# Altium schematic sheet CONTROLLER-RK3562.SchDoc
size A2; SheetNumber: 3; SheetTotal: 32
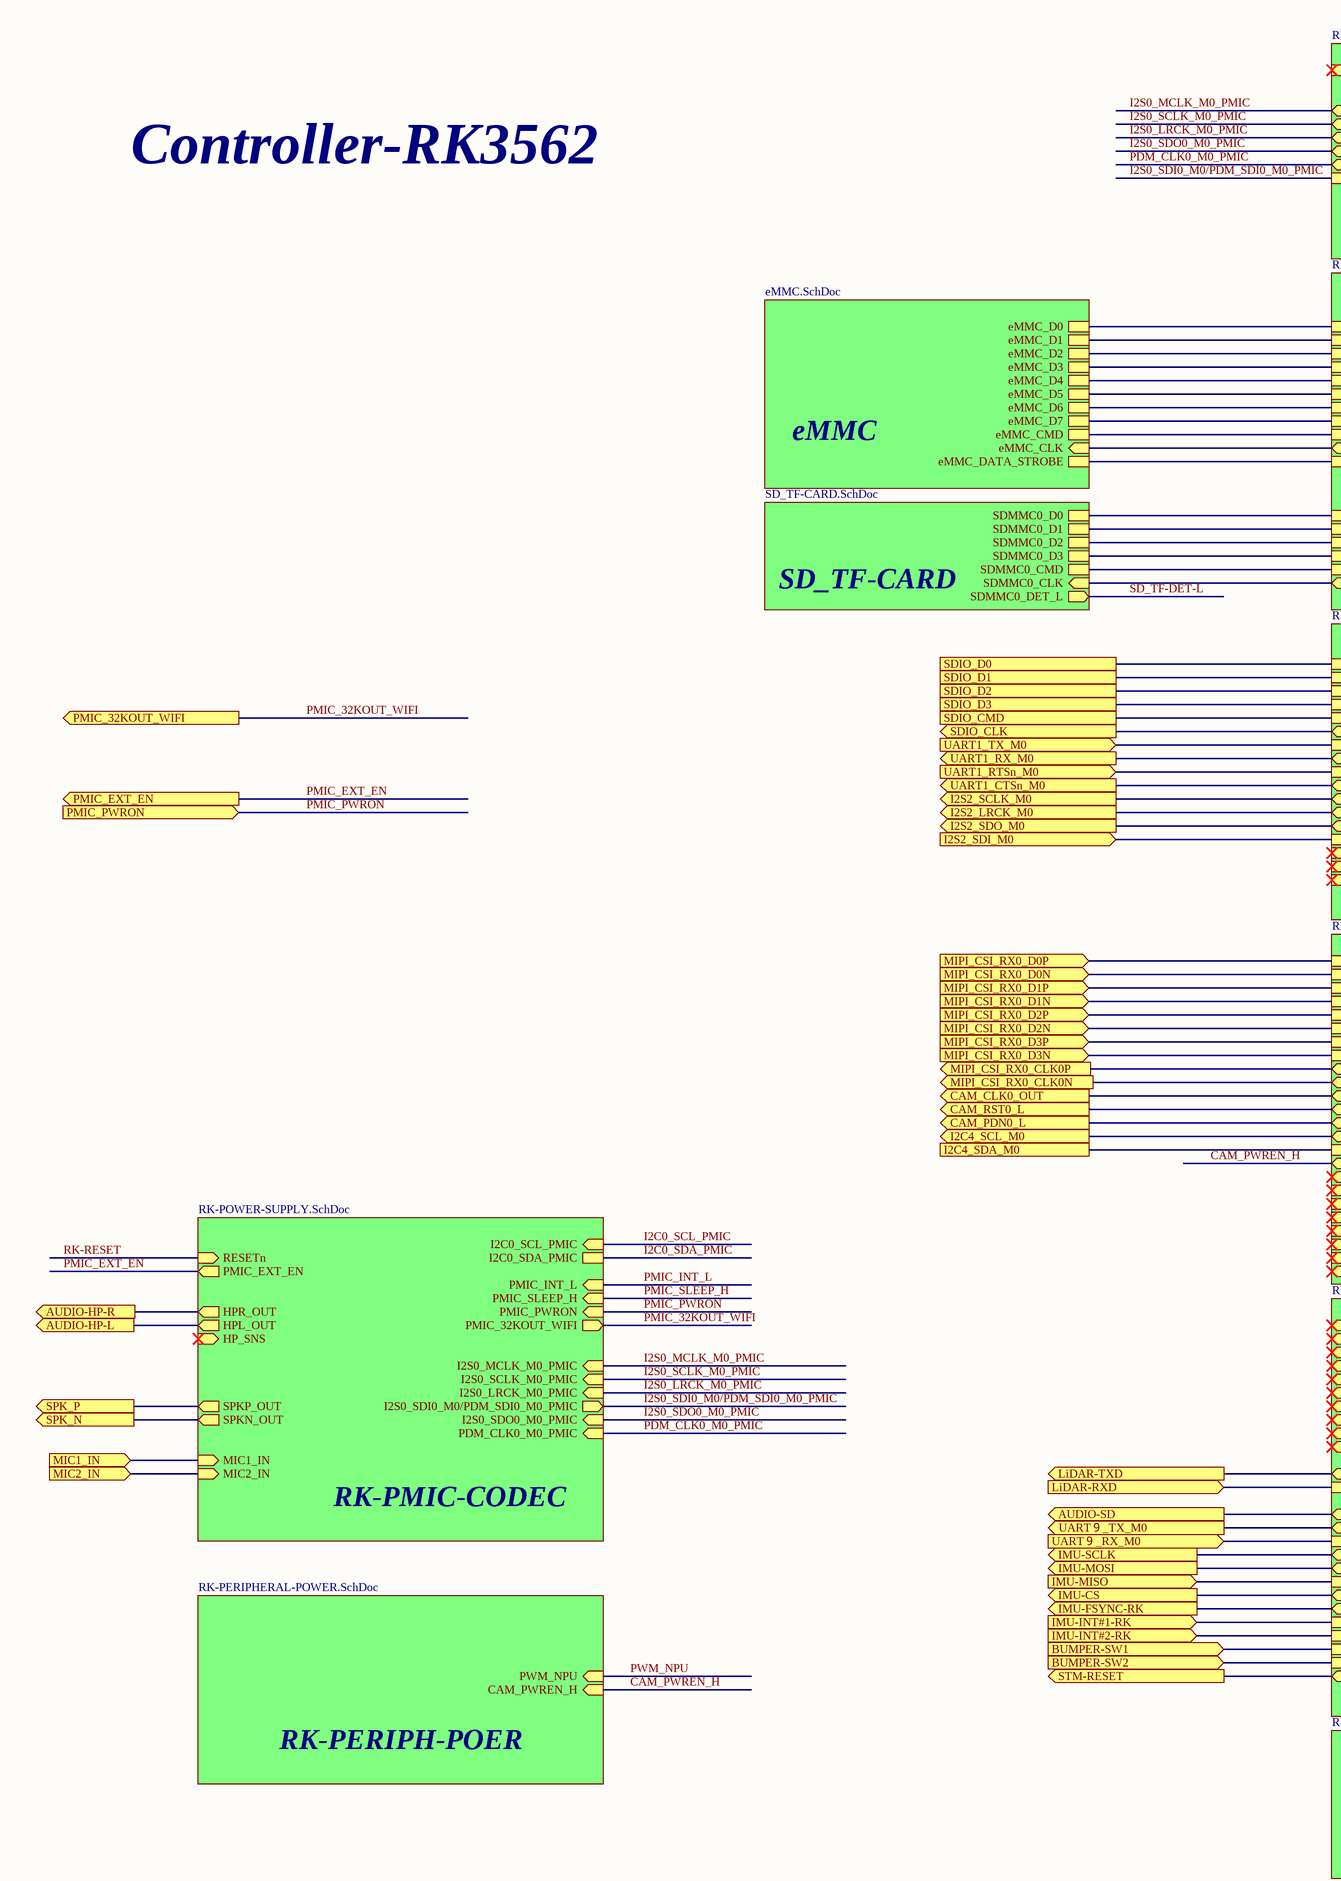
[diagram p0: CONTROLLER-RK3562.SchDoc, left]
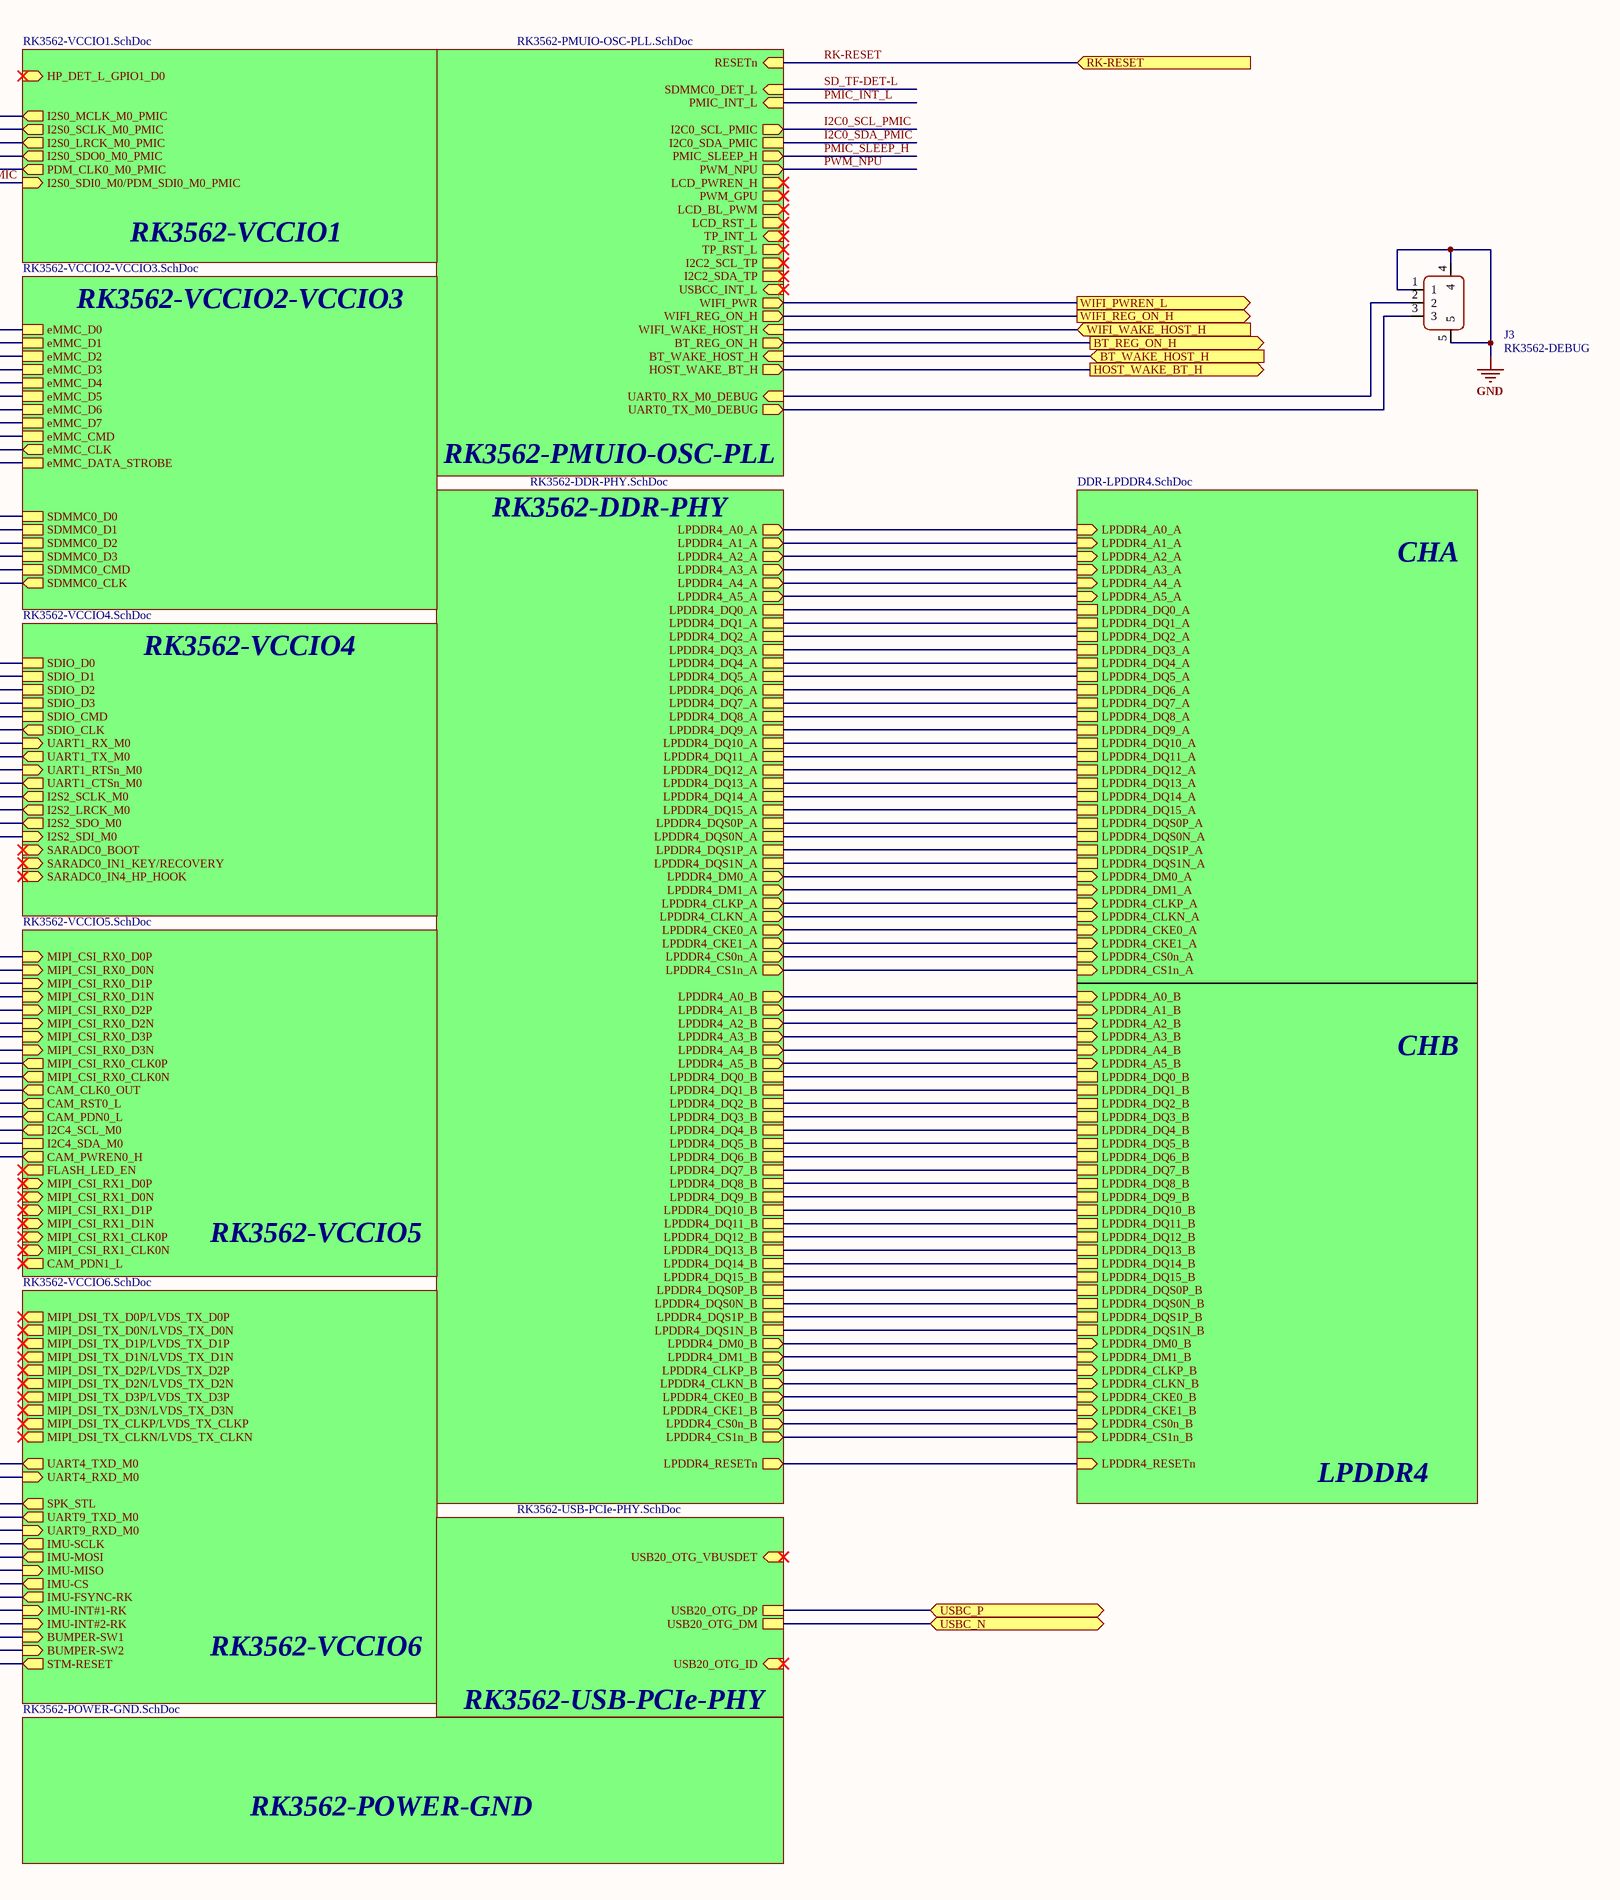
[diagram p1: CONTROLLER-RK3562.SchDoc, right]

## Parts
J3  RK3562-DEBUG  [MHDR1X3]

## Sub-sheets
DRAM-LPDDR4 = DDR-LPDDR4.SchDoc: LPDDR4_DQ0_B, LPDDR4_DQ0_A, LPDDR4_DQ1_B, LPDDR4_DQ1_A, LPDDR4_DQ2_B, LPDDR4_DQ2_A, LPDDR4_DQ3_B, LPDDR4_DQ3_A, LPDDR4_DQ4_A, LPDDR4_DQ4_B, LPDDR4_DQ5_A, LPDDR4_DQ5_B, LPDDR4_DQ6_A, LPDDR4_DQ6_B, LPDDR4_DQ7_B, LPDDR4_DQ7_A, LPDDR4_DQS0P_B, LPDDR4_DQS0P_A, LPDDR4_DQS0N_A, LPDDR4_DQS0N_B, LPDDR4_DM0_B (in), LPDDR4_DQ8_B, LPDDR4_DQ8_A, LPDDR4_DQ9_B, LPDDR4_DQ9_A, LPDDR4_DQ10_B, LPDDR4_DQ10_A, LPDDR4_DQ11_A, LPDDR4_DQ11_B, LPDDR4_DQ12_A, LPDDR4_DQ12_B, LPDDR4_DQ13_B, LPDDR4_DQ13_A, LPDDR4_DQ14_B, LPDDR4_DQ14_A, LPDDR4_DQ15_B, LPDDR4_DQ15_A, LPDDR4_DQS1P_A, LPDDR4_DQS1P_B, LPDDR4_DQS1N_B, LPDDR4_DQS1N_A, LPDDR4_DM1_B (in), LPDDR4_A0_A (in), LPDDR4_A0_B (in), LPDDR4_A1_B (in), LPDDR4_A1_A (in), LPDDR4_A2_A (in), LPDDR4_A2_B (in), LPDDR4_A3_B (in), LPDDR4_A3_A (in), LPDDR4_A4_B (in), LPDDR4_A4_A (in), LPDDR4_A5_B (in), LPDDR4_A5_A (in), LPDDR4_CLKP_B (in), LPDDR4_CLKP_A (in), LPDDR4_CLKN_B (in), LPDDR4_CLKN_A (in), LPDDR4_CKE0_B (in), LPDDR4_CKE0_A (in), LPDDR4_CKE1_A (in), LPDDR4_CKE1_B (in), LPDDR4_CS0n_A (in), LPDDR4_CS0n_B (in), LPDDR4_CS1n_A (in), LPDDR4_CS1n_B (in), LPDDR4_RESETn (in), LPDDR4_DM0_A (in), LPDDR4_DM1_A (in)
eMMC = eMMC.SchDoc: eMMC_D0, eMMC_D1, eMMC_D2, eMMC_D3, eMMC_D4, eMMC_D5, eMMC_D6, eMMC_D7, eMMC_CMD, eMMC_DATA_STROBE, eMMC_CLK (in)
RK3562-DDR-PHY = RK3562-DDR-PHY.SchDoc: LPDDR4_CLKN_B (out), LPDDR4_DQ0_A, LPDDR4_DQ1_A, LPDDR4_DQ2_A, LPDDR4_A1_A (out), LPDDR4_DQ3_A, LPDDR4_CS0n_A (out), LPDDR4_DQ4_A, LPDDR4_DQ5_A, LPDDR4_A3_B (out), LPDDR4_A5_B (out), LPDDR4_DQ6_A, LPDDR4_A1_B (out), LPDDR4_DQ7_A, LPDDR4_A0_B (out), LPDDR4_DM0_A (out), LPDDR4_DQS0P_A, LPDDR4_CLKP_B (out), LPDDR4_DQS0N_A, LPDDR4_CKE0_B (out), LPDDR4_A0_A (out), LPDDR4_DQ8_A, LPDDR4_A3_A (out), LPDDR4_DQ9_A, LPDDR4_DQ10_A, LPDDR4_A4_A (out), LPDDR4_DQ11_A, LPDDR4_A2_A (out), LPDDR4_DQ12_A, LPDDR4_DQ13_A, LPDDR4_A5_A (out), LPDDR4_DQ14_A, LPDDR4_CKE1_B (out), LPDDR4_DQ15_A, LPDDR4_A2_B (out), LPDDR4_A4_B (out), LPDDR4_DM1_A (out), LPDDR4_DQS1P_A, LPDDR4_CKE0_A (out), LPDDR4_DQS1N_A, LPDDR4_CLKN_A (out), LPDDR4_DQ0_B, LPDDR4_CLKP_A (out), LPDDR4_DQ1_B, LPDDR4_CKE1_A (out), LPDDR4_DQ2_B, LPDDR4_DQ3_B, LPDDR4_CS1n_A (out), LPDDR4_DQ4_B, LPDDR4_CS1n_B (out), LPDDR4_DQ5_B, LPDDR4_CS0n_B (out), LPDDR4_DQ6_B, LPDDR4_DQ7_B, LPDDR4_RESETn (out), LPDDR4_DM0_B (out), LPDDR4_DQS0P_B, LPDDR4_DQS0N_B, LPDDR4_DQ8_B, LPDDR4_DQ9_B, LPDDR4_DQ10_B, LPDDR4_DQ11_B, LPDDR4_DQ12_B, LPDDR4_DQ13_B, LPDDR4_DQ14_B, LPDDR4_DQ15_B, LPDDR4_DM1_B (out), LPDDR4_DQS1P_B, LPDDR4_DQS1N_B
RK3562-PMUIO-OSC-PLL = RK3562-PMUIO-OSC-PLL.SchDoc: RESETn (in), WIFI_PWR (out), PMIC_SLEEP_H (out), PMIC_INT_L (in), SDMMC0_DET_L (in), USBCC_INT_L (in), LCD_PWREN_H (out), I2C0_SCL_PMIC (out), I2C0_SDA_PMIC, WIFI_REG_ON_H (out), WIFI_WAKE_HOST_H (in), I2C2_SCL_TP (out), I2C2_SDA_TP, TP_RST_L (out), PWM_GPU (out), PWM_NPU (out), LCD_BL_PWM (out), TP_INT_L (in), LCD_RST_L (out), BT_REG_ON_H (out), BT_WAKE_HOST_H (in), HOST_WAKE_BT_H (out), UART0_RX_M0_DEBUG (in), UART0_TX_M0_DEBUG (out)
RK3562-POWER = RK3562-POWER-GND.SchDoc: no entries
RK3562-USB-PCIe-PHY = RK3562-USB-PCIe-PHY.SchDoc: USB20_OTG_DP, USB20_OTG_DM, USB20_OTG_VBUSDET (in), USB20_OTG_ID (in)
RK3562-VCCIO1 = RK3562-VCCIO1.SchDoc: HP_DET_L_GPIO1_D0 (in), I2S0_MCLK_M0_PMIC (out), I2S0_SCLK_M0_PMIC (out), I2S0_LRCK_M0_PMIC (out), I2S0_SDO0_M0_PMIC (out), PDM_CLK0_M0_PMIC (out), I2S0_SDI0_M0/PDM_SDI0_M0_PMIC (in)
RK3562-VCCIO2-VCCIO3 = RK3562-VCCIO2-VCCIO3.SchDoc: eMMC_D0, eMMC_D1, eMMC_D2, eMMC_D3, eMMC_D4, eMMC_D5, eMMC_D6, eMMC_D7, eMMC_CMD, eMMC_CLK (out), eMMC_DATA_STROBE, SDMMC0_D0, SDMMC0_D1, SDMMC0_D2, SDMMC0_D3, SDMMC0_CMD, SDMMC0_CLK (out)
RK3562-VCCIO4 = RK3562-VCCIO4.SchDoc: SDIO_D0, SDIO_D1, SDIO_D2, SDIO_D3, SDIO_CMD, SDIO_CLK (out), UART1_RX_M0 (in), UART1_TX_M0 (out), UART1_RTSn_M0 (in), UART1_CTSn_M0 (out), I2S2_SCLK_M0 (out), I2S2_LRCK_M0 (out), I2S2_SDO_M0 (out), I2S2_SDI_M0 (in), SARADC0_BOOT (in), SARADC0_IN1_KEY/RECOVERY (in), SARADC0_IN4_HP_HOOK (in)
RK3562-VCCIO5 = RK3562-VCCIO5.SchDoc: MIPI_CSI_RX0_D0P (in), MIPI_CSI_RX0_D0N (in), MIPI_CSI_RX0_D1P (in), MIPI_CSI_RX0_D1N (in), MIPI_CSI_RX0_D2P (in), MIPI_CSI_RX0_D2N (in), MIPI_CSI_RX0_D3P (in), MIPI_CSI_RX0_D3N (in), MIPI_CSI_RX1_D0P (in), MIPI_CSI_RX1_D0N (in), MIPI_CSI_RX1_D1P (in), MIPI_CSI_RX1_D1N (in), MIPI_CSI_RX1_CLK0P (in), MIPI_CSI_RX1_CLK0N (in), CAM_CLK0_OUT (out), CAM_PWREN0_H (out), CAM_PDN1_L (out), CAM_RST0_L (out), I2C4_SCL_M0 (out), I2C4_SDA_M0, CAM_PDN0_L (out), FLASH_LED_EN (out), MIPI_CSI_RX0_CLK0P (out), MIPI_CSI_RX0_CLK0N (out)
RK3562-VCCIO6 = RK3562-VCCIO6.SchDoc: MIPI_DSI_TX_D0P/LVDS_TX_D0P (out), MIPI_DSI_TX_D0N/LVDS_TX_D0N (out), MIPI_DSI_TX_D1P/LVDS_TX_D1P (out), MIPI_DSI_TX_D1N/LVDS_TX_D1N (out), MIPI_DSI_TX_D2P/LVDS_TX_D2P (out), MIPI_DSI_TX_D2N/LVDS_TX_D2N (out), MIPI_DSI_TX_D3P/LVDS_TX_D3P (out), MIPI_DSI_TX_D3N/LVDS_TX_D3N (out), MIPI_DSI_TX_CLKP/LVDS_TX_CLKP (out), MIPI_DSI_TX_CLKN/LVDS_TX_CLKN (out), UART4_TXD_M0 (out), UART4_RXD_M0 (in), SPK_STL (out), STM-RESET (out), BUMPER-SW1 (in), BUMPER-SW2 (in), IMU-SCLK (out), IMU-MOSI (out), IMU-MISO (in), IMU-CS (out), IMU-FSYNC-RK (out), IMU-INT#1-RK (in), IMU-INT#2-RK (in), UART9_TXD_M0 (out), UART9_RXD_M0 (in)
RK-PERIPHERAL-POWER = RK-PERIPHERAL-POWER.SchDoc: PWM_NPU (in), CAM_PWREN_H (in)
RK-POWER-SUPPLY = RK-POWER-SUPPLY.SchDoc: HPL_OUT (out), HP_SNS (in), I2C0_SDA_PMIC, HPR_OUT (out), PMIC_INT_L (in), SPKN_OUT (out), RESETn (in), SPKP_OUT (out), MIC1_IN (in), PMIC_32KOUT_WIFI (out), MIC2_IN (in), I2S0_MCLK_M0_PMIC (in), I2S0_SCLK_M0_PMIC (in), I2S0_LRCK_M0_PMIC (in), I2S0_SDO0_M0_PMIC (in), I2S0_SDI0_M0/PDM_SDI0_M0_PMIC (out), PDM_CLK0_M0_PMIC (in), I2C0_SCL_PMIC (in), PMIC_PWRON (in), PMIC_SLEEP_H (in), PMIC_EXT_EN (out)
SD/TF CARD = SD_TF-CARD.SchDoc: SDMMC0_D0, SDMMC0_D1, SDMMC0_D2, SDMMC0_D3, SDMMC0_CMD, SDMMC0_CLK (in), SDMMC0_DET_L (out)

## Ports
AUDIO-HP-L (out, see Controller-RK3562-TOP[6C], SPEAKER-MIC[1A]), AUDIO-HP-R (out, see Controller-RK3562-TOP[6C], SPEAKER-MIC[1A]), AUDIO-SD (out, see Controller-RK3562-TOP[6C], SPEAKER-MIC[1B]), BT_REG_ON_H (out, see Controller-RK3562-TOP[5C], RK3562-PMUIO-OSC-PLL[5C], WF-BT-AP6256[1A]), BT_WAKE_HOST_H (in, see Controller-RK3562-TOP[5C], RK3562-PMUIO-OSC-PLL[5C], WF-BT-AP6256[1A]), BUMPER-SW1 (in, see Controller-RK3562-TOP[5B], RK3562-VCCIO6[4C]), BUMPER-SW2 (in, see Controller-RK3562-TOP[5B], RK3562-VCCIO6[4C]), CAM_CLK0_OUT (out, see Controller-RK3562-TOP[6B], MIPI-CAMERA[1B], RK3562-VCCIO5[4D]), CAM_PDN0_L (out, see Controller-RK3562-TOP[6B], MIPI-CAMERA[1C], RK3562-VCCIO5[4D]), CAM_RST0_L (out, see Controller-RK3562-TOP[6B], MIPI-CAMERA[1B], RK3562-VCCIO5[4D]), HOST_WAKE_BT_H (out, see Controller-RK3562-TOP[5C], RK3562-PMUIO-OSC-PLL[5C], WF-BT-AP6256[1A]), I2C4_SCL_M0 (out, see Controller-RK3562-TOP[6B], MIPI-CAMERA[1B], RK3562-VCCIO5[4D]), I2C4_SDA_M0 (see Controller-RK3562-TOP[6B], MIPI-CAMERA[1B], RK3562-VCCIO5[4D]), I2S2_LRCK_M0 (out, see Controller-RK3562-TOP[5C], RK3562-VCCIO4[4B], WF-BT-AP6256[1A]), I2S2_SCLK_M0 (out, see Controller-RK3562-TOP[5C], RK3562-VCCIO4[4B], WF-BT-AP6256[1A]), I2S2_SDI_M0 (in, see Controller-RK3562-TOP[5C], RK3562-VCCIO4[4B], WF-BT-AP6256[1B]), I2S2_SDO_M0 (out, see Controller-RK3562-TOP[5C], RK3562-VCCIO4[4B], WF-BT-AP6256[1B]), IMU-CS (out, see Controller-RK3562-TOP[6C], RK3562-VCCIO6[4D]), IMU-FSYNC-RK (out, see Controller-RK3562-TOP[6C], RK3562-VCCIO6[4C]), IMU-INT#1-RK (in, see Controller-RK3562-TOP[6C], RK3562-VCCIO6[4C]), IMU-INT#2-RK (in, see Controller-RK3562-TOP[6C], RK3562-VCCIO6[4C]), IMU-MISO (in, see Controller-RK3562-TOP[6C], RK3562-VCCIO6[4C]), IMU-MOSI (out, see Controller-RK3562-TOP[6C], RK3562-VCCIO6[4C]), IMU-SCLK (out, see Controller-RK3562-TOP[6C], RK3562-VCCIO6[4D]), LiDAR-RXD (in, see Controller-RK3562-TOP[6B], LiDAR [1B]), LiDAR-TXD (out, see Controller-RK3562-TOP[6B]), MIC1_IN (in, see Controller-RK3562-TOP[6C], RK-POWER-SUPPLY[4A], SPEAKER-MIC[1C]), MIC2_IN (in, see Controller-RK3562-TOP[6C], RK-POWER-SUPPLY[4A], SPEAKER-MIC[1D]), MIPI_CSI_RX0_CLK0N (out, see Controller-RK3562-TOP[6B], MIPI-CAMERA[1B], RK3562-VCCIO5[2B]), MIPI_CSI_RX0_CLK0P (out, see Controller-RK3562-TOP[6B], MIPI-CAMERA[1B], RK3562-VCCIO5[2A]), MIPI_CSI_RX0_D0N (in, see Controller-RK3562-TOP[6B], MIPI-CAMERA[1B], RK3562-VCCIO5[2A]), MIPI_CSI_RX0_D0P (in, see Controller-RK3562-TOP[6B], MIPI-CAMERA[1B], RK3562-VCCIO5[2A]), MIPI_CSI_RX0_D1N (in, see Controller-RK3562-TOP[6B], MIPI-CAMERA[1B], RK3562-VCCIO5[2A]), MIPI_CSI_RX0_D1P (in, see Controller-RK3562-TOP[6B], MIPI-CAMERA[1B], RK3562-VCCIO5[2A]), MIPI_CSI_RX0_D2N (in, see Controller-RK3562-TOP[6B], MIPI-CAMERA[1B], RK3562-VCCIO5[2A]), MIPI_CSI_RX0_D2P (in, see Controller-RK3562-TOP[6B], MIPI-CAMERA[1B], RK3562-VCCIO5[2A]), MIPI_CSI_RX0_D3N (in, see Controller-RK3562-TOP[6B], MIPI-CAMERA[1B], RK3562-VCCIO5[2A]), MIPI_CSI_RX0_D3P (in, see Controller-RK3562-TOP[6B], MIPI-CAMERA[1B], RK3562-VCCIO5[2A]), PMIC_32KOUT_WIFI (out, see Controller-RK3562-TOP[5C], RK-POWER-SUPPLY[1A], WF-BT-AP6256[1B]), PMIC_EXT_EN (out, see Controller-RK3562-TOP[5C], BMS-SYSTEM-POWER[1D], RK-POWER-SUPPLY[1A]), PMIC_PWRON (in, see Controller-RK3562-TOP[5C], RK-POWER-SUPPLY[1A], STM32G070RBT6[2B]), RK-RESET (in, see Controller-RK3562-TOP[5B], STM32G070RBT6[2C]), SDIO_CLK (out, see Controller-RK3562-TOP[6C], RK3562-VCCIO4[4A], WF-BT-AP6256[1A]), SDIO_CMD (see Controller-RK3562-TOP[6C], RK3562-VCCIO4[4A], WF-BT-AP6256[1A]), SDIO_D0 (see Controller-RK3562-TOP[6C], RK3562-VCCIO4[4A], WF-BT-AP6256[1A]), SDIO_D1 (see Controller-RK3562-TOP[6C], RK3562-VCCIO4[4A], WF-BT-AP6256[1A]), SDIO_D2 (see Controller-RK3562-TOP[6C], RK3562-VCCIO4[4A], WF-BT-AP6256[1A]), SDIO_D3 (see Controller-RK3562-TOP[6C], RK3562-VCCIO4[4A], WF-BT-AP6256[1A]), SPK_N (out, see Controller-RK3562-TOP[6C], SPEAKER-MIC[3C]), SPK_P (out, see Controller-RK3562-TOP[6C], SPEAKER-MIC[3C]), STM-RESET (out, see Controller-RK3562-TOP[5B], RK3562-VCCIO6[4C], STM32G070RBT6[1A]), UART1_CTSn_M0 (out, see Controller-RK3562-TOP[5C], RK3562-VCCIO4[4B], WF-BT-AP6256[1A]), UART1_RTSn_M0 (in, see Controller-RK3562-TOP[5C], RK3562-VCCIO4[4B], WF-BT-AP6256[1A]), UART1_RX_M0 (out, see Controller-RK3562-TOP[6C], WF-BT-AP6256[1A]), UART1_TX_M0 (in, see Controller-RK3562-TOP[5C], WF-BT-AP6256[1A]), UART９_RX_M0 (in, see Controller-RK3562-TOP[5B]), UART９_TX_M0 (out, see Controller-RK3562-TOP[5B]), USBC_N (bidir, see Controller-RK3562-TOP[5C], BMS-SYSTEM-POWER[8B]), USBC_P (bidir, see Controller-RK3562-TOP[5C], BMS-SYSTEM-POWER[8B]), WIFI_PWREN_L (out, see Controller-RK3562-TOP[5C], WF-BT-AP6256[1B]), WIFI_REG_ON_H (out, see Controller-RK3562-TOP[6C], RK3562-PMUIO-OSC-PLL[5C], WF-BT-AP6256[1A]), WIFI_WAKE_HOST_H (in, see Controller-RK3562-TOP[6C], RK3562-PMUIO-OSC-PLL[5C], WF-BT-AP6256[1A])

## Nets
GND: J3.1 J3.4 J3.5
AUDIO-HP-L: port AUDIO-HP-L, sheet RK-POWER-SUPPLY/HPL_OUT
AUDIO-HP-R: port AUDIO-HP-R, sheet RK-POWER-SUPPLY/HPR_OUT
AUDIO-SD: port AUDIO-SD, sheet RK3562-VCCIO6/SPK_STL
BT_REG_ON_H: port BT_REG_ON_H, sheet RK3562-PMUIO-OSC-PLL/BT_REG_ON_H
BT_WAKE_HOST_H: port BT_WAKE_HOST_H, sheet RK3562-PMUIO-OSC-PLL/BT_WAKE_HOST_H
BUMPER-SW1: port BUMPER-SW1, sheet RK3562-VCCIO6/BUMPER-SW1
BUMPER-SW2: port BUMPER-SW2, sheet RK3562-VCCIO6/BUMPER-SW2
CAM_CLK0_OUT: port CAM_CLK0_OUT, sheet RK3562-VCCIO5/CAM_CLK0_OUT
CAM_PDN0_L: port CAM_PDN0_L, sheet RK3562-VCCIO5/CAM_PDN0_L
CAM_PWREN_H: sheet RK3562-VCCIO5/CAM_PWREN0_H, sheet RK-PERIPHERAL-POWER/CAM_PWREN_H
CAM_RST0_L: port CAM_RST0_L, sheet RK3562-VCCIO5/CAM_RST0_L
HOST_WAKE_BT_H: port HOST_WAKE_BT_H, sheet RK3562-PMUIO-OSC-PLL/HOST_WAKE_BT_H
I2C0_SCL_PMIC: sheet RK3562-PMUIO-OSC-PLL/I2C0_SCL_PMIC, sheet RK-POWER-SUPPLY/I2C0_SCL_PMIC
I2C0_SDA_PMIC: sheet RK3562-PMUIO-OSC-PLL/I2C0_SDA_PMIC, sheet RK-POWER-SUPPLY/I2C0_SDA_PMIC
I2C4_SCL_M0: port I2C4_SCL_M0, sheet RK3562-VCCIO5/I2C4_SCL_M0
I2C4_SDA_M0: port I2C4_SDA_M0, sheet RK3562-VCCIO5/I2C4_SDA_M0
I2S0_LRCK_M0_PMIC: sheet RK3562-VCCIO1/I2S0_LRCK_M0_PMIC, sheet RK-POWER-SUPPLY/I2S0_LRCK_M0_PMIC
I2S0_MCLK_M0_PMIC: sheet RK3562-VCCIO1/I2S0_MCLK_M0_PMIC, sheet RK-POWER-SUPPLY/I2S0_MCLK_M0_PMIC
I2S0_SCLK_M0_PMIC: sheet RK3562-VCCIO1/I2S0_SCLK_M0_PMIC, sheet RK-POWER-SUPPLY/I2S0_SCLK_M0_PMIC
I2S0_SDI0_M0/PDM_SDI0_M0_PMIC: sheet RK3562-VCCIO1/I2S0_SDI0_M0/PDM_SDI0_M0_PMIC, sheet RK-POWER-SUPPLY/I2S0_SDI0_M0/PDM_SDI0_M0_PMIC
I2S0_SDO0_M0_PMIC: sheet RK3562-VCCIO1/I2S0_SDO0_M0_PMIC, sheet RK-POWER-SUPPLY/I2S0_SDO0_M0_PMIC
I2S2_LRCK_M0: port I2S2_LRCK_M0, sheet RK3562-VCCIO4/I2S2_LRCK_M0
I2S2_SCLK_M0: port I2S2_SCLK_M0, sheet RK3562-VCCIO4/I2S2_SCLK_M0
I2S2_SDI_M0: port I2S2_SDI_M0, sheet RK3562-VCCIO4/I2S2_SDI_M0
I2S2_SDO_M0: port I2S2_SDO_M0, sheet RK3562-VCCIO4/I2S2_SDO_M0
IMU-CS: port IMU-CS, sheet RK3562-VCCIO6/IMU-CS
IMU-FSYNC-RK: port IMU-FSYNC-RK, sheet RK3562-VCCIO6/IMU-FSYNC-RK
IMU-INT#1-RK: port IMU-INT#1-RK, sheet RK3562-VCCIO6/IMU-INT#1-RK
IMU-INT#2-RK: port IMU-INT#2-RK, sheet RK3562-VCCIO6/IMU-INT#2-RK
IMU-MISO: port IMU-MISO, sheet RK3562-VCCIO6/IMU-MISO
IMU-MOSI: port IMU-MOSI, sheet RK3562-VCCIO6/IMU-MOSI
IMU-SCLK: port IMU-SCLK, sheet RK3562-VCCIO6/IMU-SCLK
LiDAR-RXD: port LiDAR-RXD, sheet RK3562-VCCIO6/UART4_RXD_M0
LiDAR-TXD: port LiDAR-TXD, sheet RK3562-VCCIO6/UART4_TXD_M0
MIC1_IN: port MIC1_IN, sheet RK-POWER-SUPPLY/MIC1_IN
MIC2_IN: port MIC2_IN, sheet RK-POWER-SUPPLY/MIC2_IN
MIPI_CSI_RX0_CLK0N: port MIPI_CSI_RX0_CLK0N, sheet RK3562-VCCIO5/MIPI_CSI_RX0_CLK0N
MIPI_CSI_RX0_CLK0P: port MIPI_CSI_RX0_CLK0P, sheet RK3562-VCCIO5/MIPI_CSI_RX0_CLK0P
MIPI_CSI_RX0_D0N: port MIPI_CSI_RX0_D0N, sheet RK3562-VCCIO5/MIPI_CSI_RX0_D0N
MIPI_CSI_RX0_D0P: port MIPI_CSI_RX0_D0P, sheet RK3562-VCCIO5/MIPI_CSI_RX0_D0P
MIPI_CSI_RX0_D1N: port MIPI_CSI_RX0_D1N, sheet RK3562-VCCIO5/MIPI_CSI_RX0_D1N
MIPI_CSI_RX0_D1P: port MIPI_CSI_RX0_D1P, sheet RK3562-VCCIO5/MIPI_CSI_RX0_D1P
MIPI_CSI_RX0_D2N: port MIPI_CSI_RX0_D2N, sheet RK3562-VCCIO5/MIPI_CSI_RX0_D2N
MIPI_CSI_RX0_D2P: port MIPI_CSI_RX0_D2P, sheet RK3562-VCCIO5/MIPI_CSI_RX0_D2P
MIPI_CSI_RX0_D3N: port MIPI_CSI_RX0_D3N, sheet RK3562-VCCIO5/MIPI_CSI_RX0_D3N
MIPI_CSI_RX0_D3P: port MIPI_CSI_RX0_D3P, sheet RK3562-VCCIO5/MIPI_CSI_RX0_D3P
PDM_CLK0_M0_PMIC: sheet RK3562-VCCIO1/PDM_CLK0_M0_PMIC, sheet RK-POWER-SUPPLY/PDM_CLK0_M0_PMIC
PMIC_32KOUT_WIFI: port PMIC_32KOUT_WIFI, sheet RK-POWER-SUPPLY/PMIC_32KOUT_WIFI
PMIC_EXT_EN: port PMIC_EXT_EN, sheet RK-POWER-SUPPLY/PMIC_EXT_EN
PMIC_INT_L: sheet RK3562-PMUIO-OSC-PLL/PMIC_INT_L, sheet RK-POWER-SUPPLY/PMIC_INT_L
PMIC_PWRON: port PMIC_PWRON, sheet RK-POWER-SUPPLY/PMIC_PWRON
PMIC_SLEEP_H: sheet RK3562-PMUIO-OSC-PLL/PMIC_SLEEP_H, sheet RK-POWER-SUPPLY/PMIC_SLEEP_H
PWM_NPU: sheet RK3562-PMUIO-OSC-PLL/PWM_NPU, sheet RK-PERIPHERAL-POWER/PWM_NPU
RK-RESET: port RK-RESET, sheet RK3562-PMUIO-OSC-PLL/RESETn, sheet RK-POWER-SUPPLY/RESETn
SD_TF-DET-L: sheet RK3562-PMUIO-OSC-PLL/SDMMC0_DET_L, sheet SD/TF CARD/SDMMC0_DET_L
SDIO_CLK: port SDIO_CLK, sheet RK3562-VCCIO4/SDIO_CLK
SDIO_CMD: port SDIO_CMD, sheet RK3562-VCCIO4/SDIO_CMD
SDIO_D0: port SDIO_D0, sheet RK3562-VCCIO4/SDIO_D0
SDIO_D1: port SDIO_D1, sheet RK3562-VCCIO4/SDIO_D1
SDIO_D2: port SDIO_D2, sheet RK3562-VCCIO4/SDIO_D2
SDIO_D3: port SDIO_D3, sheet RK3562-VCCIO4/SDIO_D3
SPK_N: port SPK_N, sheet RK-POWER-SUPPLY/SPKN_OUT
SPK_P: port SPK_P, sheet RK-POWER-SUPPLY/SPKP_OUT
STM-RESET: port STM-RESET, sheet RK3562-VCCIO6/STM-RESET
UART1_CTSn_M0: port UART1_CTSn_M0, sheet RK3562-VCCIO4/UART1_CTSn_M0
UART1_RTSn_M0: port UART1_RTSn_M0, sheet RK3562-VCCIO4/UART1_RTSn_M0
UART1_RX_M0: port UART1_RX_M0, sheet RK3562-VCCIO4/UART1_TX_M0
UART1_TX_M0: port UART1_TX_M0, sheet RK3562-VCCIO4/UART1_RX_M0
UART９_RX_M0: port UART９_RX_M0, sheet RK3562-VCCIO6/UART9_RXD_M0
UART９_TX_M0: port UART９_TX_M0, sheet RK3562-VCCIO6/UART9_TXD_M0
USBC_N: port USBC_N, sheet RK3562-USB-PCIe-PHY/USB20_OTG_DM
USBC_P: port USBC_P, sheet RK3562-USB-PCIe-PHY/USB20_OTG_DP
WIFI_PWREN_L: port WIFI_PWREN_L, sheet RK3562-PMUIO-OSC-PLL/WIFI_PWR
WIFI_REG_ON_H: port WIFI_REG_ON_H, sheet RK3562-PMUIO-OSC-PLL/WIFI_REG_ON_H
WIFI_WAKE_HOST_H: port WIFI_WAKE_HOST_H, sheet RK3562-PMUIO-OSC-PLL/WIFI_WAKE_HOST_H
NetJ3_2: J3.2 ; sheet RK3562-PMUIO-OSC-PLL/UART0_RX_M0_DEBUG
NetJ3_3: J3.3 ; sheet RK3562-PMUIO-OSC-PLL/UART0_TX_M0_DEBUG
(unnamed): sheet eMMC/eMMC_D0, sheet RK3562-VCCIO2-VCCIO3/eMMC_D0
(unnamed): sheet eMMC/eMMC_D1, sheet RK3562-VCCIO2-VCCIO3/eMMC_D1
(unnamed): sheet eMMC/eMMC_D2, sheet RK3562-VCCIO2-VCCIO3/eMMC_D2
(unnamed): sheet eMMC/eMMC_D3, sheet RK3562-VCCIO2-VCCIO3/eMMC_D3
(unnamed): sheet eMMC/eMMC_D4, sheet RK3562-VCCIO2-VCCIO3/eMMC_D4
(unnamed): sheet eMMC/eMMC_D5, sheet RK3562-VCCIO2-VCCIO3/eMMC_D5
(unnamed): sheet eMMC/eMMC_D6, sheet RK3562-VCCIO2-VCCIO3/eMMC_D6
(unnamed): sheet eMMC/eMMC_D7, sheet RK3562-VCCIO2-VCCIO3/eMMC_D7
(unnamed): sheet eMMC/eMMC_CMD, sheet RK3562-VCCIO2-VCCIO3/eMMC_CMD
(unnamed): sheet eMMC/eMMC_DATA_STROBE, sheet RK3562-VCCIO2-VCCIO3/eMMC_DATA_STROBE
(unnamed): sheet eMMC/eMMC_CLK, sheet RK3562-VCCIO2-VCCIO3/eMMC_CLK
(unnamed): sheet RK3562-DDR-PHY/LPDDR4_CLKN_B, sheet DRAM-LPDDR4/LPDDR4_CLKN_B
(unnamed): sheet RK3562-DDR-PHY/LPDDR4_DQ0_A, sheet DRAM-LPDDR4/LPDDR4_DQ0_A
(unnamed): sheet RK3562-DDR-PHY/LPDDR4_DQ1_A, sheet DRAM-LPDDR4/LPDDR4_DQ1_A
(unnamed): sheet RK3562-DDR-PHY/LPDDR4_DQ2_A, sheet DRAM-LPDDR4/LPDDR4_DQ2_A
(unnamed): sheet RK3562-DDR-PHY/LPDDR4_A1_A, sheet DRAM-LPDDR4/LPDDR4_A1_A
(unnamed): sheet RK3562-DDR-PHY/LPDDR4_DQ3_A, sheet DRAM-LPDDR4/LPDDR4_DQ3_A
(unnamed): sheet RK3562-DDR-PHY/LPDDR4_CS0n_A, sheet DRAM-LPDDR4/LPDDR4_CS0n_A
(unnamed): sheet RK3562-DDR-PHY/LPDDR4_DQ4_A, sheet DRAM-LPDDR4/LPDDR4_DQ4_A
(unnamed): sheet RK3562-DDR-PHY/LPDDR4_DQ5_A, sheet DRAM-LPDDR4/LPDDR4_DQ5_A
(unnamed): sheet RK3562-DDR-PHY/LPDDR4_A3_B, sheet DRAM-LPDDR4/LPDDR4_A3_B
(unnamed): sheet RK3562-DDR-PHY/LPDDR4_A5_B, sheet DRAM-LPDDR4/LPDDR4_A5_B
(unnamed): sheet RK3562-DDR-PHY/LPDDR4_DQ6_A, sheet DRAM-LPDDR4/LPDDR4_DQ6_A
(unnamed): sheet RK3562-DDR-PHY/LPDDR4_A1_B, sheet DRAM-LPDDR4/LPDDR4_A1_B
(unnamed): sheet RK3562-DDR-PHY/LPDDR4_DQ7_A, sheet DRAM-LPDDR4/LPDDR4_DQ7_A
(unnamed): sheet RK3562-DDR-PHY/LPDDR4_A0_B, sheet DRAM-LPDDR4/LPDDR4_A0_B
(unnamed): sheet RK3562-DDR-PHY/LPDDR4_DM0_A, sheet DRAM-LPDDR4/LPDDR4_DM0_A
(unnamed): sheet RK3562-DDR-PHY/LPDDR4_DQS0P_A, sheet DRAM-LPDDR4/LPDDR4_DQS0P_A
(unnamed): sheet RK3562-DDR-PHY/LPDDR4_CLKP_B, sheet DRAM-LPDDR4/LPDDR4_CLKP_B
(unnamed): sheet RK3562-DDR-PHY/LPDDR4_DQS0N_A, sheet DRAM-LPDDR4/LPDDR4_DQS0N_A
(unnamed): sheet RK3562-DDR-PHY/LPDDR4_CKE0_B, sheet DRAM-LPDDR4/LPDDR4_CKE0_B
(unnamed): sheet RK3562-DDR-PHY/LPDDR4_A0_A, sheet DRAM-LPDDR4/LPDDR4_A0_A
(unnamed): sheet RK3562-DDR-PHY/LPDDR4_DQ8_A, sheet DRAM-LPDDR4/LPDDR4_DQ8_A
(unnamed): sheet RK3562-DDR-PHY/LPDDR4_A3_A, sheet DRAM-LPDDR4/LPDDR4_A3_A
(unnamed): sheet RK3562-DDR-PHY/LPDDR4_DQ9_A, sheet DRAM-LPDDR4/LPDDR4_DQ9_A
(unnamed): sheet RK3562-DDR-PHY/LPDDR4_DQ10_A, sheet DRAM-LPDDR4/LPDDR4_DQ10_A
(unnamed): sheet RK3562-DDR-PHY/LPDDR4_A4_A, sheet DRAM-LPDDR4/LPDDR4_A4_A
(unnamed): sheet RK3562-DDR-PHY/LPDDR4_DQ11_A, sheet DRAM-LPDDR4/LPDDR4_DQ11_A
(unnamed): sheet RK3562-DDR-PHY/LPDDR4_A2_A, sheet DRAM-LPDDR4/LPDDR4_A2_A
(unnamed): sheet RK3562-DDR-PHY/LPDDR4_DQ12_A, sheet DRAM-LPDDR4/LPDDR4_DQ12_A
(unnamed): sheet RK3562-DDR-PHY/LPDDR4_DQ13_A, sheet DRAM-LPDDR4/LPDDR4_DQ13_A
(unnamed): sheet RK3562-DDR-PHY/LPDDR4_A5_A, sheet DRAM-LPDDR4/LPDDR4_A5_A
(unnamed): sheet RK3562-DDR-PHY/LPDDR4_DQ14_A, sheet DRAM-LPDDR4/LPDDR4_DQ14_A
(unnamed): sheet RK3562-DDR-PHY/LPDDR4_CKE1_B, sheet DRAM-LPDDR4/LPDDR4_CKE1_B
(unnamed): sheet RK3562-DDR-PHY/LPDDR4_DQ15_A, sheet DRAM-LPDDR4/LPDDR4_DQ15_A
(unnamed): sheet RK3562-DDR-PHY/LPDDR4_A2_B, sheet DRAM-LPDDR4/LPDDR4_A2_B
(unnamed): sheet RK3562-DDR-PHY/LPDDR4_A4_B, sheet DRAM-LPDDR4/LPDDR4_A4_B
(unnamed): sheet RK3562-DDR-PHY/LPDDR4_DM1_A, sheet DRAM-LPDDR4/LPDDR4_DM1_A
(unnamed): sheet RK3562-DDR-PHY/LPDDR4_DQS1P_A, sheet DRAM-LPDDR4/LPDDR4_DQS1P_A
(unnamed): sheet RK3562-DDR-PHY/LPDDR4_CKE0_A, sheet DRAM-LPDDR4/LPDDR4_CKE0_A
(unnamed): sheet RK3562-DDR-PHY/LPDDR4_DQS1N_A, sheet DRAM-LPDDR4/LPDDR4_DQS1N_A
(unnamed): sheet RK3562-DDR-PHY/LPDDR4_CLKN_A, sheet DRAM-LPDDR4/LPDDR4_CLKN_A
(unnamed): sheet RK3562-DDR-PHY/LPDDR4_DQ0_B, sheet DRAM-LPDDR4/LPDDR4_DQ0_B
(unnamed): sheet RK3562-DDR-PHY/LPDDR4_CLKP_A, sheet DRAM-LPDDR4/LPDDR4_CLKP_A
(unnamed): sheet RK3562-DDR-PHY/LPDDR4_DQ1_B, sheet DRAM-LPDDR4/LPDDR4_DQ1_B
(unnamed): sheet RK3562-DDR-PHY/LPDDR4_CKE1_A, sheet DRAM-LPDDR4/LPDDR4_CKE1_A
(unnamed): sheet RK3562-DDR-PHY/LPDDR4_DQ2_B, sheet DRAM-LPDDR4/LPDDR4_DQ2_B
(unnamed): sheet RK3562-DDR-PHY/LPDDR4_DQ3_B, sheet DRAM-LPDDR4/LPDDR4_DQ3_B
(unnamed): sheet RK3562-DDR-PHY/LPDDR4_CS1n_A, sheet DRAM-LPDDR4/LPDDR4_CS1n_A
(unnamed): sheet RK3562-DDR-PHY/LPDDR4_DQ4_B, sheet DRAM-LPDDR4/LPDDR4_DQ4_B
(unnamed): sheet RK3562-DDR-PHY/LPDDR4_CS1n_B, sheet DRAM-LPDDR4/LPDDR4_CS1n_B
(unnamed): sheet RK3562-DDR-PHY/LPDDR4_DQ5_B, sheet DRAM-LPDDR4/LPDDR4_DQ5_B
(unnamed): sheet RK3562-DDR-PHY/LPDDR4_CS0n_B, sheet DRAM-LPDDR4/LPDDR4_CS0n_B
(unnamed): sheet RK3562-DDR-PHY/LPDDR4_DQ6_B, sheet DRAM-LPDDR4/LPDDR4_DQ6_B
(unnamed): sheet RK3562-DDR-PHY/LPDDR4_DQ7_B, sheet DRAM-LPDDR4/LPDDR4_DQ7_B
(unnamed): sheet RK3562-DDR-PHY/LPDDR4_RESETn, sheet DRAM-LPDDR4/LPDDR4_RESETn
(unnamed): sheet RK3562-DDR-PHY/LPDDR4_DM0_B, sheet DRAM-LPDDR4/LPDDR4_DM0_B
(unnamed): sheet RK3562-DDR-PHY/LPDDR4_DQS0P_B, sheet DRAM-LPDDR4/LPDDR4_DQS0P_B
(unnamed): sheet RK3562-DDR-PHY/LPDDR4_DQS0N_B, sheet DRAM-LPDDR4/LPDDR4_DQS0N_B
(unnamed): sheet RK3562-DDR-PHY/LPDDR4_DQ8_B, sheet DRAM-LPDDR4/LPDDR4_DQ8_B
(unnamed): sheet RK3562-DDR-PHY/LPDDR4_DQ9_B, sheet DRAM-LPDDR4/LPDDR4_DQ9_B
(unnamed): sheet RK3562-DDR-PHY/LPDDR4_DQ10_B, sheet DRAM-LPDDR4/LPDDR4_DQ10_B
(unnamed): sheet RK3562-DDR-PHY/LPDDR4_DQ11_B, sheet DRAM-LPDDR4/LPDDR4_DQ11_B
(unnamed): sheet RK3562-DDR-PHY/LPDDR4_DQ12_B, sheet DRAM-LPDDR4/LPDDR4_DQ12_B
(unnamed): sheet RK3562-DDR-PHY/LPDDR4_DQ13_B, sheet DRAM-LPDDR4/LPDDR4_DQ13_B
(unnamed): sheet RK3562-DDR-PHY/LPDDR4_DQ14_B, sheet DRAM-LPDDR4/LPDDR4_DQ14_B
(unnamed): sheet RK3562-DDR-PHY/LPDDR4_DQ15_B, sheet DRAM-LPDDR4/LPDDR4_DQ15_B
(unnamed): sheet RK3562-DDR-PHY/LPDDR4_DM1_B, sheet DRAM-LPDDR4/LPDDR4_DM1_B
(unnamed): sheet RK3562-DDR-PHY/LPDDR4_DQS1P_B, sheet DRAM-LPDDR4/LPDDR4_DQS1P_B
(unnamed): sheet RK3562-DDR-PHY/LPDDR4_DQS1N_B, sheet DRAM-LPDDR4/LPDDR4_DQS1N_B
(unnamed): sheet RK3562-VCCIO2-VCCIO3/SDMMC0_D0, sheet SD/TF CARD/SDMMC0_D0
(unnamed): sheet RK3562-VCCIO2-VCCIO3/SDMMC0_D1, sheet SD/TF CARD/SDMMC0_D1
(unnamed): sheet RK3562-VCCIO2-VCCIO3/SDMMC0_D2, sheet SD/TF CARD/SDMMC0_D2
(unnamed): sheet RK3562-VCCIO2-VCCIO3/SDMMC0_D3, sheet SD/TF CARD/SDMMC0_D3
(unnamed): sheet RK3562-VCCIO2-VCCIO3/SDMMC0_CMD, sheet SD/TF CARD/SDMMC0_CMD
(unnamed): sheet RK3562-VCCIO2-VCCIO3/SDMMC0_CLK, sheet SD/TF CARD/SDMMC0_CLK

## Notes on the sheet
- Controller-RK3562
- RK3562-VCCIO1
- RK3562-VCCIO2-VCCIO3
- eMMC
- RK3562-PMUIO-OSC-PLL
- RK3562-DDR-PHY
- SD_TF-CARD
- CHA
- RK3562-VCCIO4
- CHB
- RK3562-VCCIO5
- RK-PMIC-CODEC
- LPDDR4
- RK3562-VCCIO6
- RK3562-USB-PCIe-PHY
- RK-PERIPH-POER
- RK3562-POWER-GND

## Library data of the parts
J3 = HDRx3: ManufacturingPartNumber: *; Manufacturer: *; SupplierPartNumber: *; Supplier: *; VoltageRate: *